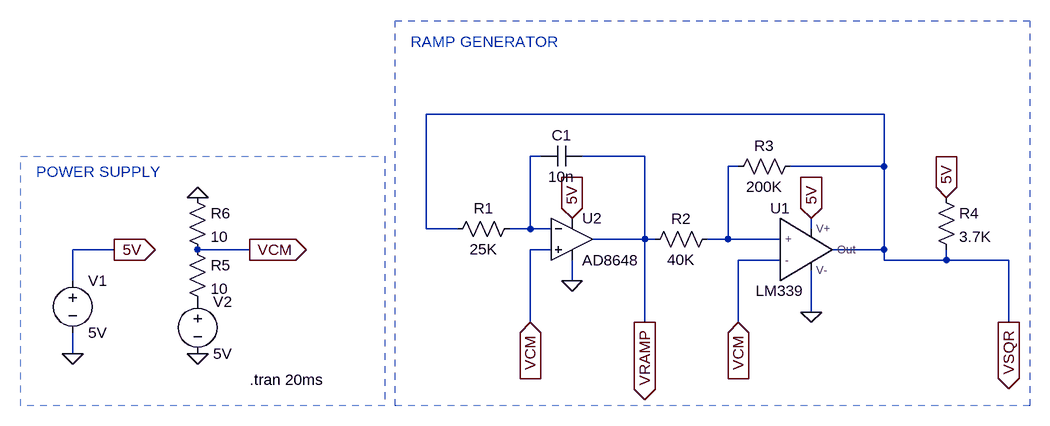
[diagram p0: schematic Analog1.asc]
Analog1.asc, the LTspice schematic file:
Version 4
SHEET 1 880 680
WIRE 272 48 -432 48
WIRE -256 112 -272 112
WIRE -96 112 -192 112
WIRE 48 128 32 128
WIRE 272 128 272 48
WIRE 272 128 128 128
WIRE -432 224 -432 48
WIRE -384 224 -432 224
WIRE -272 224 -272 112
WIRE -272 224 -304 224
WIRE -240 224 -272 224
WIRE 160 224 160 208
WIRE -96 240 -96 112
WIRE -96 240 -176 240
WIRE -80 240 -96 240
WIRE 32 240 32 128
WIRE 32 240 0 240
WIRE 112 240 32 240
WIRE -912 256 -976 256
WIRE -704 256 -784 256
WIRE -240 256 -272 256
WIRE 272 256 272 128
WIRE 272 256 192 256
WIRE 112 272 48 272
WIRE 272 272 272 256
WIRE 368 272 368 256
WIRE 368 272 272 272
WIRE 464 272 368 272
WIRE -976 304 -976 256
WIRE -208 304 -208 272
WIRE 160 352 160 288
WIRE -272 368 -272 256
WIRE -96 368 -96 240
WIRE 48 368 48 272
WIRE 464 368 464 272
WIRE -976 416 -976 384
FLAG -208 304 0
FLAG -976 416 0
FLAG 160 352 0
FLAG -96 368 VRAMP
IOPIN -96 368 Out
FLAG 464 368 VSQR
IOPIN 464 368 Out
FLAG -272 368 VCM
IOPIN -272 368 In
FLAG 48 368 VCM
IOPIN 48 368 In
FLAG -208 208 5V
IOPIN -208 208 In
FLAG 160 208 5V
IOPIN 160 208 In
FLAG -912 256 5V
IOPIN -912 256 Out
FLAG -784 416 0
FLAG -784 176 0
FLAG -704 256 VCM
IOPIN -704 256 Out
FLAG 368 176 5V
IOPIN 368 176 In
SYMBOL OpAmps\\AD8648 -208 176 R0
SYMATTR InstName U2
SYMBOL res 16 224 R90
WINDOW 0 0 56 VBottom 2
WINDOW 3 32 56 VTop 2
SYMATTR InstName R2
SYMATTR Value 40K
SYMBOL res 144 112 R90
WINDOW 0 0 56 VBottom 2
WINDOW 3 32 56 VTop 2
SYMATTR InstName R3
SYMATTR Value 200K
SYMBOL res -288 208 R90
WINDOW 0 0 56 VBottom 2
WINDOW 3 32 56 VTop 2
SYMATTR InstName R1
SYMATTR Value 25K
SYMBOL cap -192 96 R90
WINDOW 0 0 32 VBottom 2
WINDOW 3 32 32 VTop 2
SYMATTR InstName C1
SYMATTR Value 10n
SYMBOL voltage -976 288 R0
WINDOW 123 0 0 Left 0
WINDOW 39 0 0 Left 0
SYMATTR InstName V1
SYMATTR Value 5V
SYMBOL res 352 160 R0
SYMATTR InstName R4
SYMATTR Value 3.7K
SYMBOL LM339.New 144 256 R0
SYMATTR InstName U1
SYMBOL voltage -784 320 R0
WINDOW 123 0 0 Left 0
WINDOW 39 0 0 Left 0
SYMATTR InstName V2
SYMATTR Value 5V
SYMBOL res -800 240 R0
SYMATTR InstName R5
SYMATTR Value 10
SYMBOL res -800 160 R0
SYMATTR InstName R6
SYMATTR Value 10
TEXT -1032 136 Left 2 ;POWER SUPPLY
TEXT -456 -64 Left 2 ;RAMP GENERATOR
TEXT -704 456 Left 2 !.tran 20ms
RECTANGLE Normal 496 496 -480 -96 2
RECTANGLE Normal -496 496 -1056 112 2

The netlist it stands for:
* Analog1.asc
XU2 VCM N001 5V 0 VRAMP AD8648  ; pins In+ In- V+ V- OUT
R2 N002 VRAMP 40K
R3 VSQR N002 200K
R1 N001 VSQR 25K
C1 VRAMP N001 10n
V1 5V 0 5V
R4 5V VSQR 3.7K
XU1 N002 VCM 5V 0 VSQR LM339  ; pins + - V+ V- Out
V2 P001 0 5V
R5 VCM P001 10
R6 0 VCM 10
* POWER SUPPLY
* RAMP GENERATOR
.tran 20ms
.lib ADI.lib
.lib A:\Electronic LAB\LM339.new.sub
.backanno
.end